# Altium project Pressure sensor.PrjPcb
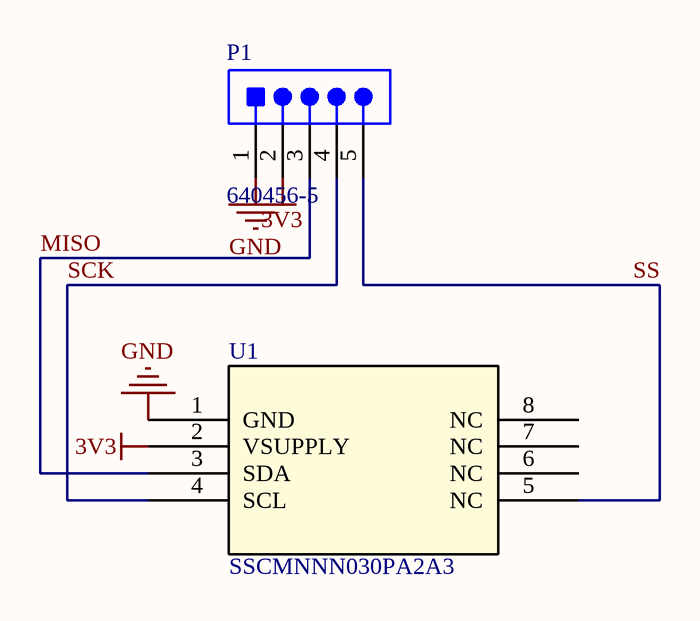
[diagram p0: Pressure Sensor.SchDoc]
1 sheet, 2 parts. Net scope: global (net labels, ports and power ports of the same name join across sheets).
Board file: Pressure Sensor.PcbDoc

## Sheet Pressure Sensor.SchDoc
size A

### Parts
P1  640456-5  [TECO-640456-5]
U1  SSCMNNN030PA2A3  [SSCMNN_HNW-L]

### Nets
3V3: P1.2(RXI) U1.2(VSUPPLY)
GND: P1.1(DTR) U1.1(GND)
MISO: P1.3(TXO) U1.3(SDA)
SCK: P1.4(VCC) U1.4(SCL)
SS: P1.5(CTS) U1.5(NC)

Not connected (* = marked no-connect by the designer): U1 6(NC) 7(NC) 8(NC)

### Library data of the parts
P1 = CMP-1684-00014-1: Male Header, Pitch 2.54 mm, 1 x 5 Position, Height 10.03 mm, Tail Length 3.56 mm, / -55 to 105 degC, RoHS, Bulk; Manufacturer: TE Connectivity; Material, Housing: Polyester; Brand/Series: MTA-100Series; Color, Housing: White; Current, Rating: 5 / A; Temperature, Operating: -55to+105 / °C; Connector Type: MTA-100; Agency Approvals: CSA,UL; Material, Contact: CopperAlloy; Mounting Hole Size: 0.04 / "; Voltage, Rating: 250 / V; Contact Termination Area Plating: Tin; Pin Spacing: 0.1 / "; Primary Type: InterconnectSystem; Special Features: Pinstrip; Mount Angle: Vertical; Contact Centerline Spacing: 0.100 / in.; Number of Contacts: 5; Standards: RoHSCompliant,ELVCompliant,UL94V-0; Angle: Straight; Length, Terminal Post: 0.14 / in.; Manufacturer URL: http://www.te.com; Flammability Rating: UL94V-0; Mounting Type: PCMount; Termination: Solder; Package Reference: THD; Length, Overall: 0.5 / "; Contact Mating Area Plating: Tin; Length, Pin: 0.14 / "; Datasheet URL: http://sigma.octopart.com/77881742/technical_drawing/TE-Connectivity-640456-5.pdf; Package Description: Male Header, Pitch 2.54 mm, 1 x 5 Position, Height 10.03 mm, Tail Length 3.56 mm; Datasheet Version: Rev. W3; Contact Plating: Tin; Color: White; Number of Positions: 5; Type: PCBPlug; Contact Shape: Square; Number of Rows: 1; Size, Post: 0.025 / in.
U1 = SSCMNNN030PA2A3: No Description Available; Vendor: Honeywell; Built_By: EMA_Cory; SourceLibrary: Honeywell_2020-09-30; Datasheet: https://sensing.honeywell.com/honeywell-sensing-trustability-ssc-series-standard-accuracy-board-mount-pressure-sensors-50099533-a-en.pdf; Manufacturer_Part_Number: SSCMNNN030PA2A3; Copyright: Copyright (C) 2018 Accelerated Designs. All rights reserved; RefDes: RefDes; Type: DEV